# Altium schematic sheet LVDS_IFC.SchDoc: LVDS & I2C
size 420 x 297 mm; Author: G.K.; CompanyName: WUT; DrawnBy: G.K.; Organization: WUT ISE; Address1: Warsaw Univeristy of Technology; Address2: Nowowiejska 15/19; Revision: -; SheetNumber: -; SheetTotal: -; EDA_Number: ARTIQ; Projet: ARTIQ/SINARA; ModifiedBy: -; CreateDate: XX/XX/XXXX; CheckedDate: -; Title2: interfaces; DivGrp: ISE; Designer: G.K.; ModifiedDate: -; ProjectName: 32 CHANNEL 16bit DAC
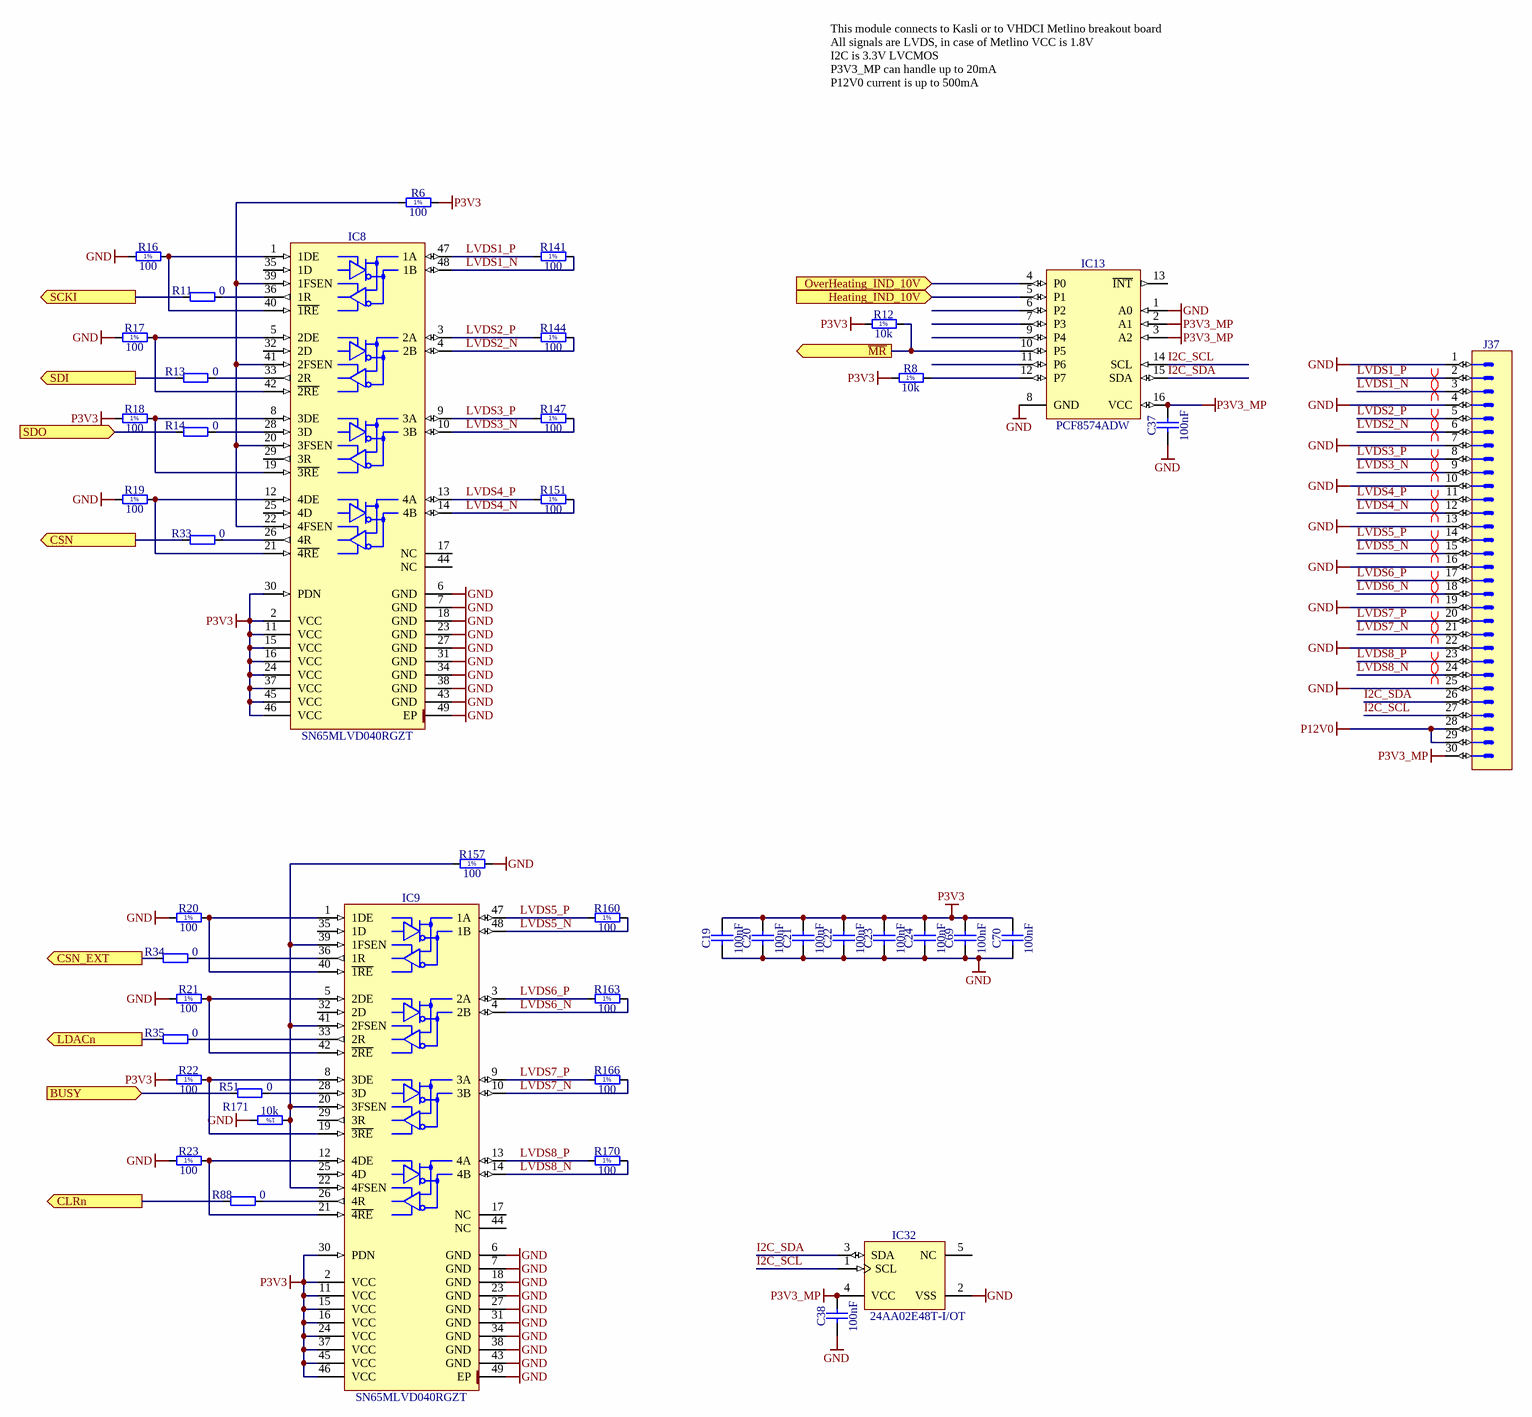
[diagram p0: LVDS_IFC.SchDoc]

## Parts
C19  100nF  [CAPC1005X55N]
C20  100nF  [CAPC1005X55N]
C21  100nF  [CAPC1005X55N]
C22  100nF  [CAPC1005X55N]
C23  100nF  [CAPC1005X55N]
C24  100nF  [CAPC1005X55N]
C37  100nF  [CAPC1005X55N]
C38  100nF  [CAPC1005X55N]
C69  100nF  [CAPC1005X55N]
C70  100nF  [CAPC1005X55N]
IC8  SN65MLVD040RGZT  [QFN50P700X700X100-49N-S420]
IC9  SN65MLVD040RGZT  [QFN50P700X700X100-49N-S420]
IC13  PCF8574ADW  [SOIC127P1030X265-16N]
IC32  24AA02E48T-I/OT  [SOT95P280X145-5N]
J37  (no value)  [3M_N2530-6002RB]
R6  100  [RESC1005X40N]
R8  10k  [RESC1608X55N]
R11  0  [RESC1005X40N]
R12  10k  [RESC1608X55N]
R13  0  [RESC1005X40N]
R14  0  [RESC1005X40N]
R16  100  [RESC1005X40N]
R17  100  [RESC1005X40N]
R18  100  [RESC1005X40N]
R19  100  [RESC1005X40N]
R20  100  [RESC1005X40N]
R21  100  [RESC1005X40N]
R22  100  [RESC1005X40N]
R23  100  [RESC1005X40N]
R33  0  [RESC1005X40N]
R34  0  [RESC1005X40N]
R35  0  [RESC1005X40N]
R51  0  [RESC1005X40N]
R88  0  [RESC1005X40N]
R141  100  [RESC1005X40N]
R144  100  [RESC1005X40N]
R147  100  [RESC1005X40N]
R151  100  [RESC1005X40N]
R157  100  [RESC1005X40N]
R160  100  [RESC1005X40N]
R163  100  [RESC1005X40N]
R166  100  [RESC1005X40N]
R170  100  [RESC1005X40N]
R171  10k  [RESC1005X40N]

## Ports
BUSY (in), CLRn (out), CSN (out), CSN_EXT (out), Heating_IND_10V (in), LDACn (out), OverHeating_IND_10V (in), SCKI (out), SDI (out), SDO (in), ~{MR} (out)

## Nets
GND: C19.1 C20.1 C21.1 C22.1 C23.1 C24.1 C37.1 C38.1 C69.1 C70.1 IC8.6(GND) IC8.7(GND) IC8.18(GND) IC8.23(GND) IC8.27(GND) IC8.31(GND) IC8.34(GND) IC8.38(GND) IC8.43(GND) IC8.49(EP) IC9.6(GND) IC9.7(GND) IC9.18(GND) IC9.23(GND) IC9.27(GND) IC9.31(GND) IC9.34(GND) IC9.38(GND) IC9.43(GND) IC9.49(EP) IC13.1(A0) IC13.8(GND) IC32.2(VSS) J37.1 J37.4 J37.7 J37.10 J37.13 J37.16 J37.19 J37.22 J37.25 R16.1 R17.1 R19.1 R20.1 R21.1 R23.1 R157.2 R171.2
P3V3: C19.2 C20.2 C21.2 C22.2 C23.2 C24.2 C69.2 C70.2 IC8.2(VCC) IC8.11(VCC) IC8.15(VCC) IC8.16(VCC) IC8.24(VCC) IC8.30(PDN) IC8.37(VCC) IC8.45(VCC) IC8.46(VCC) IC9.2(VCC) IC9.11(VCC) IC9.15(VCC) IC9.16(VCC) IC9.24(VCC) IC9.30(PDN) IC9.37(VCC) IC9.45(VCC) IC9.46(VCC) R6.2 R8.1 R12.1 R18.1 R22.1
P3V3_MP: C37.2 C38.2 IC13.2(A1) IC13.3(A2) IC13.16(VCC) IC32.4(VCC) J37.30
P12V0: J37.28 J37.29
BUSY: R51.1 ; port BUSY
CLRn: R88.1 ; port CLRn
CSN: R33.1 ; port CSN
CSN_EXT: R34.1 ; port CSN_EXT
Heating_IND_10V: IC13.5(P1) ; port Heating_IND_10V
I2C_SCL: IC13.14(SCL) IC32.1(SCL) J37.27
I2C_SDA: IC13.15(SDA) IC32.3(SDA) J37.26
LDACn: R35.1 ; port LDACn
LVDS1_N: IC8.48(1B) J37.3 R141.2
LVDS1_P: IC8.47(1A) J37.2 R141.1
LVDS2_N: IC8.4(2B) J37.6 R144.2
LVDS2_P: IC8.3(2A) J37.5 R144.1
LVDS3_N: IC8.10(3B) J37.9 R147.2
LVDS3_P: IC8.9(3A) J37.8 R147.1
LVDS4_N: IC8.14(4B) J37.12 R151.2
LVDS4_P: IC8.13(4A) J37.11 R151.1
LVDS5_N: IC9.48(1B) J37.15 R160.2
LVDS5_P: IC9.47(1A) J37.14 R160.1
LVDS6_N: IC9.4(2B) J37.18 R163.2
LVDS6_P: IC9.3(2A) J37.17 R163.1
LVDS7_N: IC9.10(3B) J37.21 R166.2
LVDS7_P: IC9.9(3A) J37.20 R166.1
LVDS8_N: IC9.14(4B) J37.24 R170.2
LVDS8_P: IC9.13(4A) J37.23 R170.1
~{MR}: IC13.10(P5) R12.2 ; port ~{MR}
OverHeating_IND_10V: IC13.4(P0) ; port OverHeating_IND_10V
SCKI: R11.1 ; port SCKI
SDI: R13.1 ; port SDI
SDO: R14.1 ; port SDO
NetIC8_1: IC8.1(1DE) IC8.40(~{1RE}) R16.2
NetIC8_5: IC8.5(2DE) IC8.42(~{2RE}) R17.2
NetIC8_8: IC8.8(3DE) IC8.19(~{3RE}) R18.2
NetIC8_12: IC8.12(4DE) IC8.21(~{4RE}) R19.2
NetIC8_20: IC8.20(3FSEN) IC8.22(4FSEN) IC8.39(1FSEN) IC8.41(2FSEN) R6.1
NetIC8_26: IC8.26(4R) R33.2
NetIC8_28: IC8.28(3D) R14.2
NetIC8_33: IC8.33(2R) R13.2
NetIC8_36: IC8.36(1R) R11.2
NetIC9_1: IC9.1(1DE) IC9.40(~{1RE}) R20.2
NetIC9_5: IC9.5(2DE) IC9.42(~{2RE}) R21.2
NetIC9_8: IC9.8(3DE) IC9.19(~{3RE}) R22.2
NetIC9_12: IC9.12(4DE) IC9.21(~{4RE}) R23.2
NetIC9_20: IC9.20(3FSEN) IC9.22(4FSEN) IC9.39(1FSEN) IC9.41(2FSEN) R157.1 R171.1
NetIC9_26: IC9.26(4R) R88.2
NetIC9_28: IC9.28(3D) R51.2
NetIC9_33: IC9.33(2R) R35.2
NetIC9_36: IC9.36(1R) R34.2
NetIC13_12: IC13.12(P7) R8.2

Not connected (* = marked no-connect by the designer): IC8 17(NC) 25(4D) 29(3R) 32(2D) 35(1D) 44(NC); IC9 17(NC) 25(4D) 29(3R) 32(2D) 35(1D) 44(NC); IC13 6(P2) 7(P3) 9(P4) 11(P6) 13(~{INT}); IC32 5(NC)

## Layout directives
differential pair: LVDS1_N, LVDS1_P, LVDS2_N, LVDS2_P, LVDS3_N, LVDS3_P, LVDS4_N, LVDS4_P, LVDS5_N, LVDS5_P, LVDS6_N, LVDS6_P, LVDS7_N, LVDS7_P, LVDS8_N, LVDS8_P

## Notes on the sheet
- This module connects to Kasli or to VHDCI Metlino breakout board
  All signals are LVDS, in case of Metlino VCC is 1.8V
  I2C is 3.3V LVCMOS
  P3V3_MP can handle up to 20mA
  P12V0 current is up to 500mA
- Project/Equipment
- Document
- Designer
- Drawn by
- Check.by
- File
- Last Mod.
- Print Date
- Sheet
- Size
- A3
- of
- Rev
- (in symbol R0402_10K_1%_0.0625W_100PPM) 1%
- (in symbol R0402_100R_1%_0.1W_100PPM) 1%
- (in symbol R0603_10K_1%_0.1W_100PPM) 1%

## Library data of the parts
C19-C24 C37 C38 C69 C70 = CC0402_100NF_16V_10%_X5R: Non-polarised capacitor; Part Description: SMD Multilayer Chip Ceramic Capacitor; Manufacturer: GENERIC; Manufacturer1 Part Number: GRM155R61C104KA88D; Voltage: 16V; TC: X5R; Tolerance: ±10%; Part Number: CC0402_100NF_16V_10%_X5R; Component Kind: Standard; Component Type: Standard; Pin Count: 2; Value: 100nF; Status: None; Manufacturer Part Number: CC0402_100NF_16V_10%_X5R; Case: 0402; Mounted: Yes; Socket: No; SMD: Yes; Sense: No; Manufacturer1 Example: MURATA; Manufacturer1 ComponentHeight: 0.55mm; HelpURL: \\cern.ch\dfs\Applications\Altium\Datasheets\CC0402_X5R_MURATA_GRM.pdf; Author: CERN DEM JLC; CreateDate: 10.12.2013; LatestRevisionDate: 10.12.2013
IC8 IC9 = SN65MLVD040RGZT: 4-Channel Half-Duplex M-LVDS Line Transceiver; Manufacturer: TEXAS INSTRUMENTS; PressFit: No; Bonding: No; Part Number: SN65MLVD040RGZT; Component Kind: Standard; Component Type: Standard; Device: SN65MLVD040RGZT; PackageDescription: QFN, 0.50mm Pitch, Square; 48 Pin, 7.00mm L X 7.00mm W X 1mm H body (W/Thermal Tab 4.2mm X 4.2mm), IPC Medium Density; Part Description: 4-Channel Half-Duplex M-LVDS Line Transceiver; Manufacturer Part Number: SN65MLVD040RGZT; Pin Count: 49; Case: QFN48; Mounted: Yes; Socket: No; SMD: Yes; Sense: No; ComponentHeight: 1mm; Author: CERN DEM JLC; HelpURL: \\cern.ch\dfs\Applications\Altium\Datasheets\SN65MLVD040RGZT.pdf; CreateDate: 17.03.2011; LatestRevisionDate: 17.03.2011
IC13 = PCF8574ADW: Remote 8-bit I/O Expander For I2C Bus; Manufacturer: TEXAS INSTRUMENTS; PressFit: No; Bonding: No; Part Number: PCF8574ADW; Component Kind: Standard; Component Type: Standard; Device: PCF8574ADW; PackageDescription: SOIC 16, Pitch 1.27mm - Body 7.5x10.3mm, IPC Medium Density; Part Description: Remote 8-bit I/O Expander For I2C Bus; Manufacturer Part Number: PCF8574ADW; Pin Count: 16; Case: SOIC16W; Mounted: Yes; Socket: No; SMD: Yes; Sense: No; ComponentHeight: 2.65mm; Author: CERN DEM JLC; HelpURL: \\cern.ch\dfs\Applications\Altium\Datasheets\PCF8574ADW.pdf; CreateDate: 01.11.2012; LatestRevisionDate: 01.11.2012
IC32 = 24AA02E48T-I/OT: 1.7V-5.5V, 2K I2C Serial EEPROM With EUI-48 Node Identity; Manufacturer: MICROCHIP TECHNOLOGY; PressFit: No; Bonding: No; Part Number: 24AA02E48T-I/OT; Component Kind: Standard; Component Type: Standard; Device: 24AA02E48T-I/OT; PackageDescription: SOT, 0.95mm pitch; 5 pin, 1.60mm W X 2.90mm L X 1.45mm H body, IPC Medium Density; Part Description: 1.7V-5.5V, 2K I2C Serial EEPROM With EUI-48 Node Identity; Manufacturer Part Number: 24AA02E48T-I/OT; Pin Count: 5; Case: SOT23-5; Mounted: Yes; Socket: No; SMD: Yes; Sense: No; ComponentHeight: 1.45mm; HelpURL: \\cern.ch\dfs\Applications\Altium\Datasheets\24AA02E48T-I-OT.pdf; Author: CERN DEM MR; CreateDate: 31.03.2016; LatestRevisionDate: 31.03.2016
J37 = 3M_N2530-6002RB: Connector 30 Male; Part Description: 30 Contacts - Straight .100'' x .100'' Low Profile Four-Wall Header, 2500 Series; Manufacturer: 3M; PressFit: No; Part Number: 3M_N2530-6002RB; Component Kind: Standard; Component Type: Standard; Pin Count: 30; Family: Header 30; Mounted: Yes; Socket: No; SMD: No; Sense: No; Status: None; Manufacturer Part Number: N2530-6002RB; ComponentHeight: 10.03mm; HelpURL: \\cern.ch\dfs\Applications\Altium\Datasheets\3M_N2530-6002RB.pdf; Author: CERN DEM JLC; CreateDate: 11.02.2009; LatestRevisionDate: 11.08.2009
R6 R16-R23 R141 R144 R147 R151 R157 R160 R163 R166 R170 = R0402_100R_1%_0.1W_100PPM: Resistor - 1%; Part Description: General Purpose Thick Film Chip Resistor; Manufacturer: GENERIC; Manufacturer Part Number: R0402_100R_1%_0.1W_100PPM_50V; Manufacturer1 Part Number: ERJ2RKF1000X; Power: 0.1W; TC: ±100ppm/°C; Voltage: 50V; Part Number: R0402_100R_1%_0.1W_100PPM; Component Kind: Standard; Component Type: Standard; Pin Count: 2; Value: 100; Status: Not recommended; Tolerance: ±1%; Case: 0402; Mounted: Yes; Sense: No; Socket: No; SMD: Yes; Manufacturer1 Example: PANASONIC; Manufacturer1 ComponentHeight: 0.4mm; HelpURL: \\cern.ch\dfs\Applications\Altium\Datasheets\R0402_PANASONIC_ERJ2RK.pdf; Author: CERN DEM JLC; CreateDate: 12.12.2013; LatestRevisionDate: 03.03.2015
R8 R12 = R0603_10K_1%_0.1W_100PPM: Resistor - 1%; Part Description: General Purpose Thick Film Chip Resistor; Manufacturer: GENERIC; Manufacturer1 Part Number: NRC06F1002TRF; Power: 0.1W; TC: ±100ppm/°C; Part Number: R0603_10K_1%_0.1W_100PPM; Component Kind: Standard; Component Type: Standard; Pin Count: 2; Value: 10k; Status: Preferred; Tolerance: ±1%; Manufacturer Part Number: R0603_10K_1%_0.1W_100PPM; Case: 0603; Mounted: Yes; Sense: No; Socket: No; SMD: Yes; Manufacturer1 Example: NIC COMPONENT; Manufacturer1 ComponentHeight: 0.55mm; HelpURL: \\cern.ch\dfs\Applications\Altium\Datasheets\R0603_NIC_NRC.pdf; Author: CERN DEM JLC; CreateDate: 03.12.2007; LatestRevisionDate: 13.03.2008
R11 R13 R14 R33-R35 R51 R88 = R0402_0R_JUMPER: Resistor; Part Description: 1A (0.05R Max DC Resistance) Zero Ohm Jumper; Manufacturer: GENERIC; Manufacturer1 Part Number: 232270591001L; Part Number: R0402_0R_JUMPER; Component Kind: Standard; Component Type: Standard; Pin Count: 2; Value: 0; Status: Not recommended; Manufacturer Part Number: R0402_0R_JUMPER; Case: 0402; Mounted: Yes; Sense: No; Socket: No; SMD: Yes; Manufacturer1 Example: YAGEO PHYCOMP; Manufacturer1 ComponentHeight: 0.4mm; HelpURL: \\cern.ch\dfs\Applications\Altium\Datasheets\R0402_Phycomp_RC0402.pdf; Author: CERN DEM JLC; CreateDate: 03.12.2007; LatestRevisionDate: 17.10.2012
R171 = R0402_10K_1%_0.0625W_100PPM: Resistor - 1%; Part Description: General Purpose Thick Film Chip Resistor; Manufacturer: GENERIC; Manufacturer1 Part Number: 232270671003L; TC: ±100ppm/°C; Part Number: R0402_10K_1%_0.0625W_100PPM; Component Kind: Standard; Component Type: Standard; Pin Count: 2; Value: 10k; Status: Not recommended; Power: 0.0625W; Tolerance: ±1%; Manufacturer Part Number: R0402_10K_1%_0.0625W_100PPM; Case: 0402; Mounted: Yes; Sense: No; Socket: No; SMD: Yes; Manufacturer1 Example: YAGEO PHYCOMP; Manufacturer1 ComponentHeight: 0.4mm; HelpURL: \\cern.ch\dfs\Applications\Altium\Datasheets\R0402_Phycomp_RC0402.pdf; Author: CERN DEM JLC; CreateDate: 03.12.2007; LatestRevisionDate: 17.10.2012